# Altium schematic sheet Power.SchDoc
size A4; Organization: Altium Limited; Address1: L3, 12a Rodborough Rd; Address2: Frenchs Forest; Address3: NSW; Address4: Australia 2086
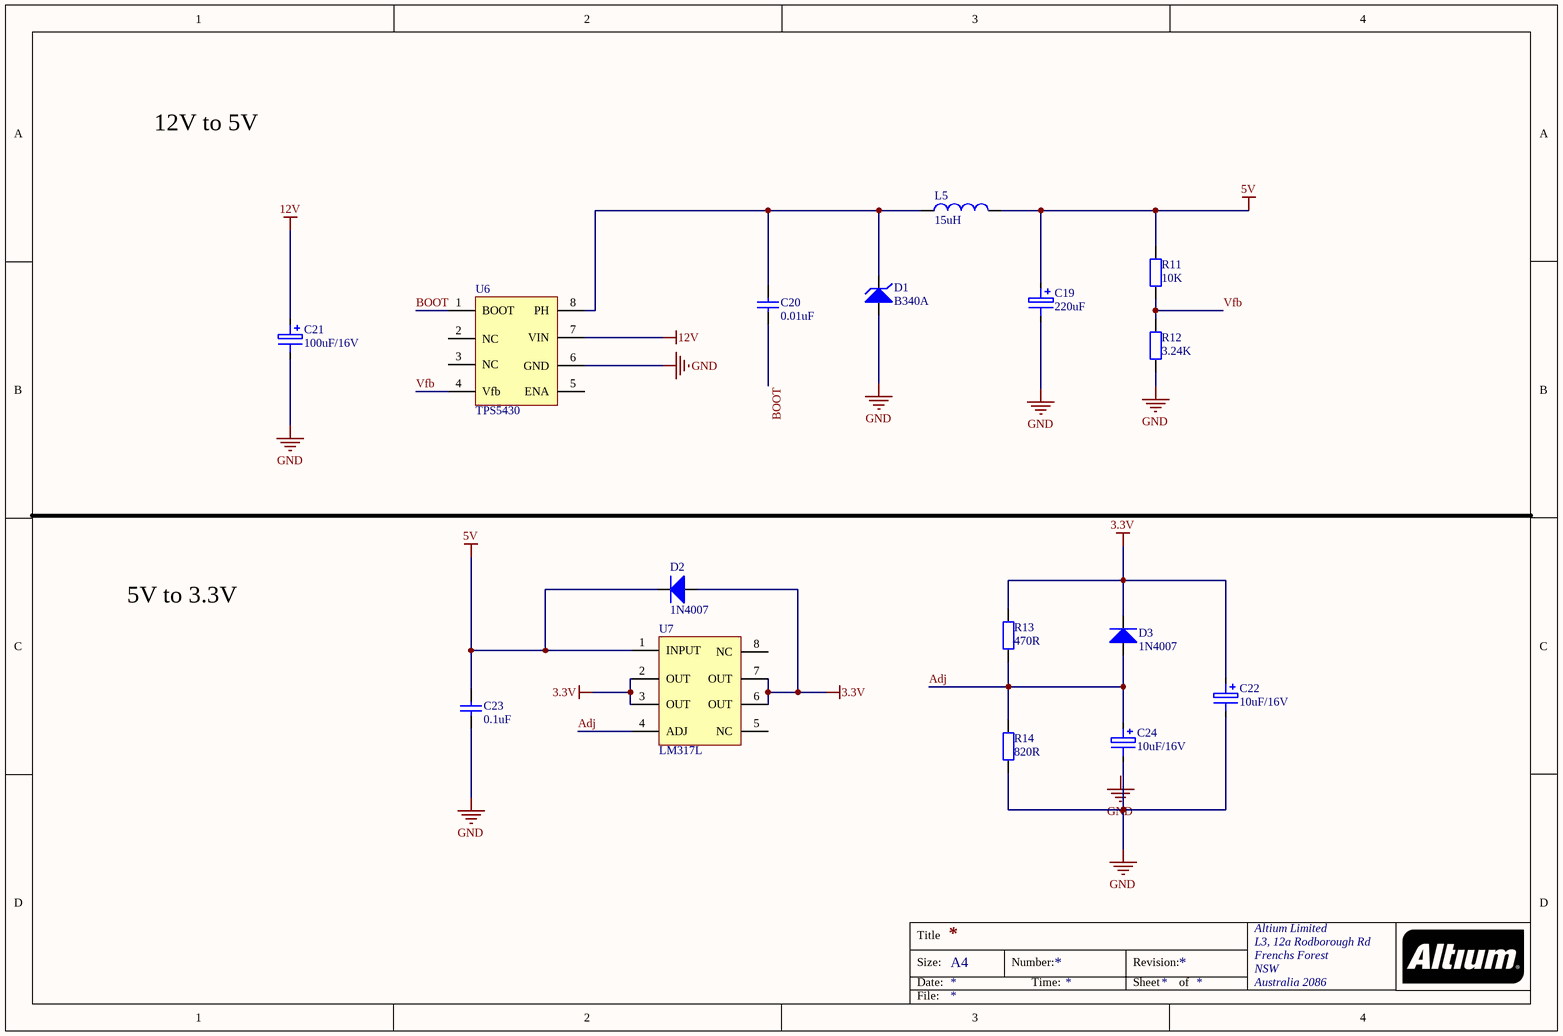
[diagram p0: Power.SchDoc]

## Parts
C19  220uF  [CAPM-7.0*4.5]
C20  0.01uF  [0603]
C21  100uF/16V  [CAPM-7.0*4.5]
C22  10uF/16V  [CAPM-5.5*3.3]
C23  0.1uF  [0603]
C24  10uF/16V  [CAPM-5.5*3.3]
D1  B340A  [DO214-AC]
D2  1N4007  [DO214-AC]
D3  1N4007  [DO214-AC]
L5  15uH  [7*7*4-15uH]
R11  10K  [0603]
R12  3.24K  [0603]
R13  470R  [0603]
R14  820R  [0603]
U6  TPS5430  [TPS5430]
U7  LM317L  [LM317L]

## Nets
3.3V: C22.1 D2.1(A) D3.2(K) R13.2 U7.2(OUT) U7.3(OUT) U7.6(OUT) U7.7(OUT)
5V: C19.1 C23.2 D2.2(K) L5.2 R11.2 U7.1(INPUT)
12V: C21.1 U6.7(VIN)
GND: C19.2 C21.2 C22.2 C23.1 C24.2 D1.1(A) R12.1 R14.1 U6.6(GND)
Adj: C24.1 D3.1(A) R13.1 R14.2 U7.4(ADJ)
BOOT: C20.1 U6.1(BOOT)
Vfb: R11.1 R12.2 U6.4(Vfb)
NetC20_2: C20.2 D1.2(K) L5.1 U6.8(PH)

Not connected (* = marked no-connect by the designer): U6 2(NC) 3(NC) 5(ENA); U7 5(NC) 8(NC)

## Notes on the sheet
- 12V to 5V
- 5V to 3.3V
- Labels drawn without touching a wire or pin: GND
- Title
- Size:
- Date:
- A4
- Number:
- Time:
- Revision:
- Sheet
- of
- File:

## Library data of the parts
C19 C21 C22 C24 = Cap3: aluminum
C20 C23 = Cap1: ceramic
D1 = B340A-13-F
L5 = Inductor
R11-R14 = Res